# EAGLE schematic Control Unit (EAGLE 9.3.0)
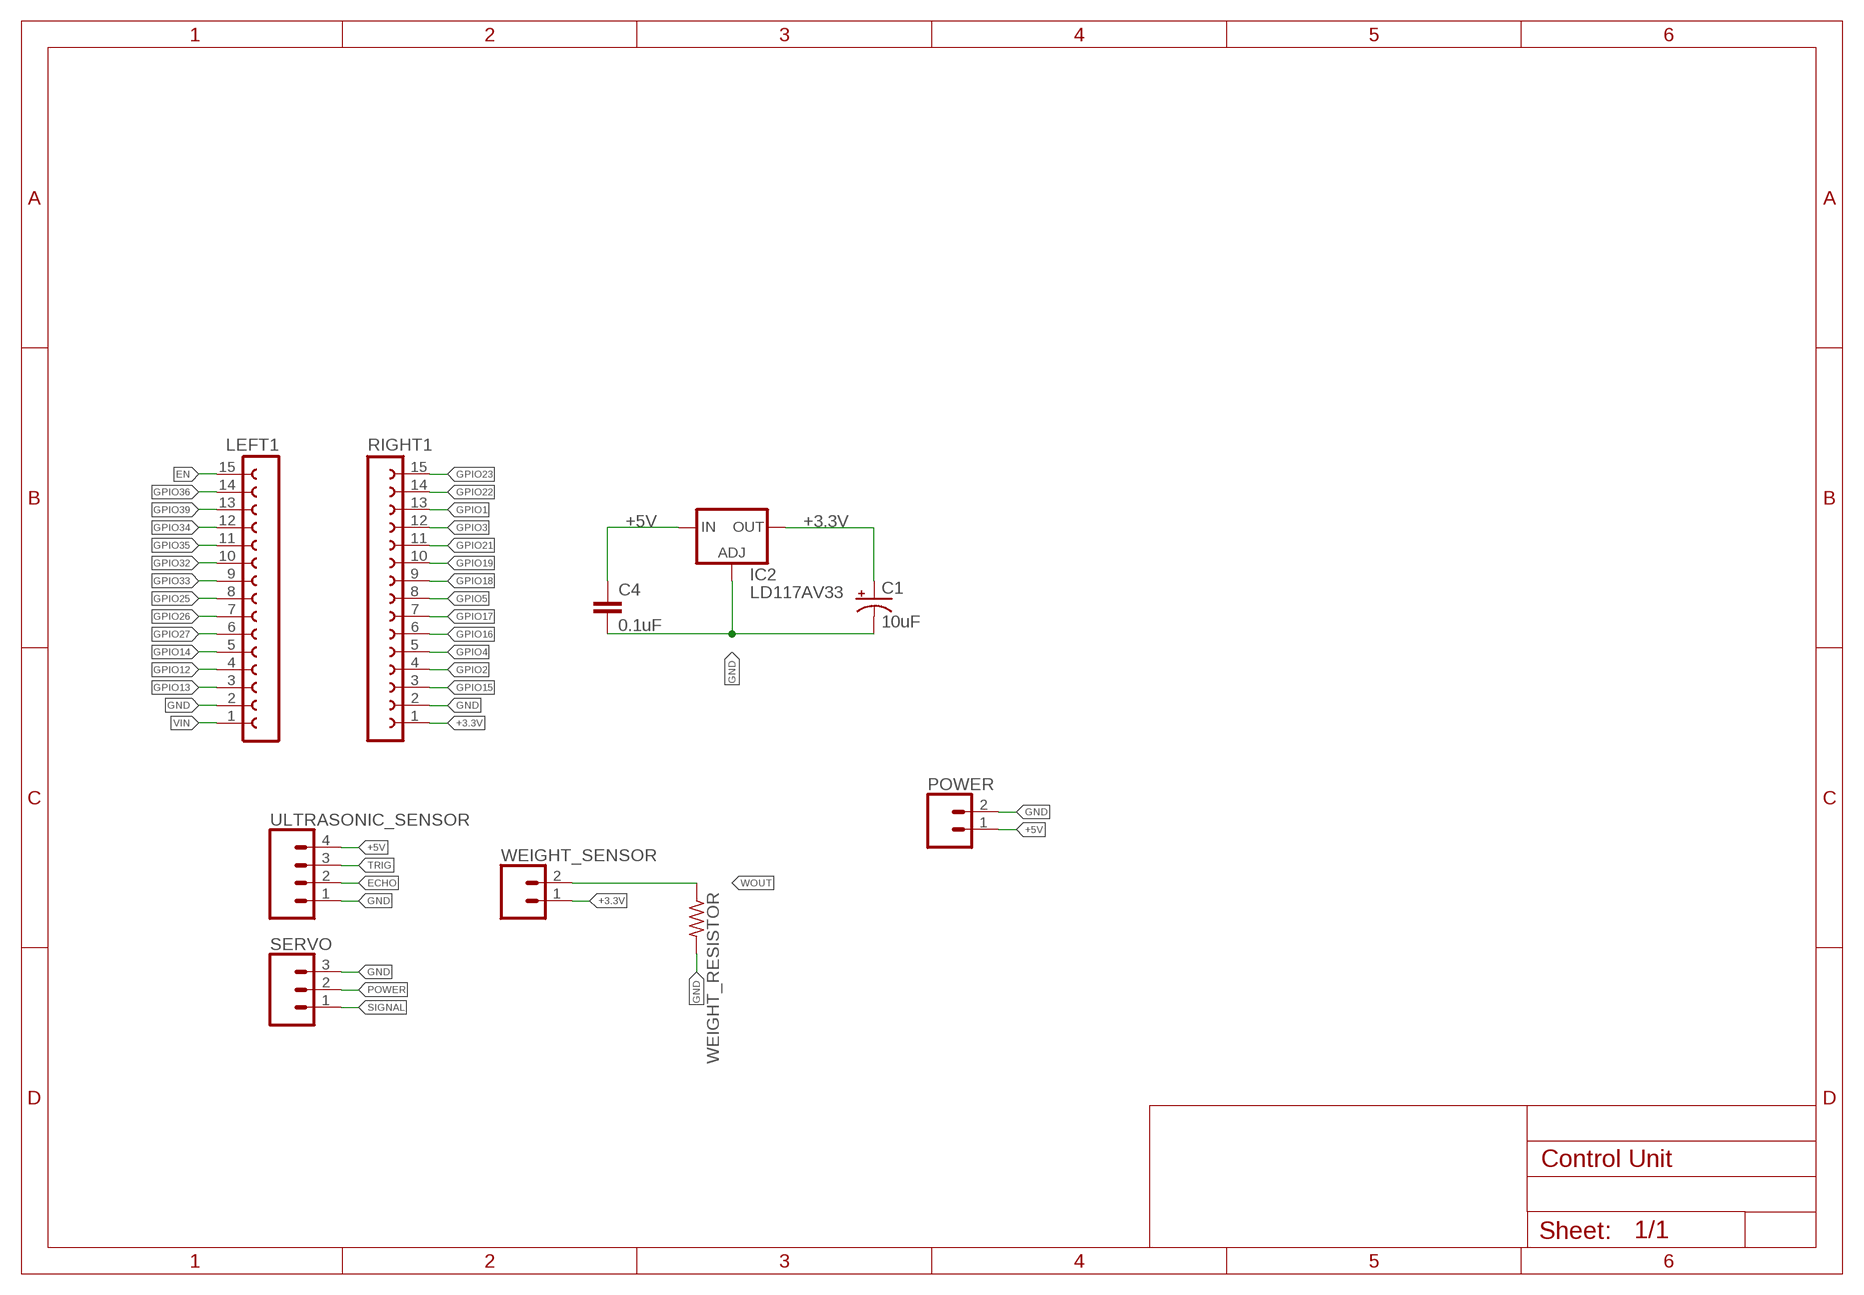
[diagram p0: schematic, sheet 1]

## Parts
C1  10uF  10UF-POLAR-RADIAL-2.5MM-KIT-25V-20%  [CPOL-RADIAL-2.5MM-5MM-KIT]
C4  0.1uF  0.1UF-KIT-EZ-50V-20%  [CAP-PTH-SMALL-KIT]
IC2  LD117AV33  [TO220L1]
LEFT1  FE15-1  [FE15]
POWER  CONN_02LOCK_LONGPADS  [1X02_LOCK_LONGPADS]
RIGHT1  FE15-1  [FE15]
SERVO  CONN_03LONGPADS  [1X03_LONGPADS]
ULTRASONIC_SENSOR  CONN_04LONGPADS  [1X04_LONGPADS]
WEIGHT_RESISTOR  R-US_0207/7  [0207/7]
WEIGHT_SENSOR  CONN_02LOCK_LONGPADS  [1X02_LOCK_LONGPADS]

## Nets
+3.3V: C1.1(+) IC2.2(OUT) RIGHT1.1 WEIGHT_SENSOR.1
+5V: C4.1 IC2.3(IN) POWER.1 ULTRASONIC_SENSOR.4
ECHO: ULTRASONIC_SENSOR.2
EN: LEFT1.15
GND: C1.2(-) C4.2 IC2.1(ADJ) LEFT1.2 POWER.2 RIGHT1.2 SERVO.3 ULTRASONIC_SENSOR.1 WEIGHT_RESISTOR.2
GPIO1: RIGHT1.13
GPIO2: RIGHT1.4
GPIO3: RIGHT1.12
GPIO4: RIGHT1.5
GPIO5: RIGHT1.8
GPIO12: LEFT1.4
GPIO13: LEFT1.3
GPIO14: LEFT1.5
GPIO15: RIGHT1.3
GPIO16: RIGHT1.6
GPIO17: RIGHT1.7
GPIO18: RIGHT1.9
GPIO19: RIGHT1.10
GPIO21: RIGHT1.11
GPIO22: RIGHT1.14
GPIO23: RIGHT1.15
GPIO25: LEFT1.8
GPIO26: LEFT1.7
GPIO27: LEFT1.6
GPIO32: LEFT1.10
GPIO33: LEFT1.9
GPIO34: LEFT1.12
GPIO35: LEFT1.11
GPIO36: LEFT1.14
GPIO39: LEFT1.13
POWER: SERVO.2
SIGNAL: SERVO.1
TRIG: ULTRASONIC_SENSOR.3
VIN: LEFT1.1
WOUT: WEIGHT_RESISTOR.1 WEIGHT_SENSOR.2

## Library data of the parts
C1 = SparkFun-Capacitors:10UF-POLAR: 10.0µF polarized capacitors A capacitor is a passive two-terminal electrical component used to store electrical energy temporarily in an electric field.; PROD_ID: CAP-08440
C4 = SparkFun-Capacitors:0.1UF: 0.1µF ceramic capacitors A capacitor is a passive two-terminal electrical component used to store electrical energy temporarily in an electric field.; PROD_ID: CAP-08370
IC2 = v-reg:LD117A?*: Low drop fixed and adjustable positive voltage regulators 1 A Source: http://www.st.com/stonline/products/literature/ds/7194/ld1117axx.pdf
LEFT1 RIGHT1 = con-lsta:FE15-1: FEMALE HEADER; OC_FARNELL: unknown; OC_NEWARK: unknown; SPICEPREFIX: X
POWER WEIGHT_SENSOR = SparkFun-Connectors:CONN_02: Multi connection point. Often used as Generic Header-pin footprint for 0.1 inch spaced/style header connections On any of the 0.1 inch spaced packages, you can populate with these: Break Away Headers - Straight <https://www.sparkfun.com/products/116> (PRT-00116) Break Away Male Headers - Right Angle <https://www.sparkfun.com/products/553> (PRT-00553) Female Headers <https://www.sparkfun.com/products/115> (PRT-00115) Break Away Headers - Machine Pin <https://www.sparkfun.com/products/117> (PRT-00117) Break Away Female Headers - Swiss Machine Pin <https://www.sparkfun.com/products/743> (PRT-00743) For SCREWTERMINALS and SPRING TERMINALS visit here: Screw Terimnals on SparkFun.com <https://www.sparkfun.com/search/results?term=Screw+Terminals> (5mm/3.5mm/2.54mm spacing) This device is also useful as a general connection point to wire up your design to another part of your project. Our various solder wires solder well into these plated through hole pads. Hook-Up Wire - Assortment (Stranded, 22 AWG) <https://www.sparkfun.com/products/11375> (PRT-11375) Hook-Up Wire - Assortment (Solid Core, 22 AWG) <https://www.sparkfun.com/products/11367> (PRT-11367) View the entire wire category on our website here <https://www.sparkfun.com/categories/141> Special notes: Molex polarized connector foot print use with: PRT-08233 with associated crimp pins and housings. 2.54_SCREWTERM for use with PRT-10571. 3.5mm Screw Terminal footprints for PRT-08084 5mm Screw Terminal footprints for use with PRT-08432
SERVO = SparkFun-Connectors:CONN_03: Multi connection point. Often used as Generic Header-pin footprint for 0.1 inch spaced/style header connections On any of the 0.1 inch spaced packages, you can populate with these: Break Away Headers - Straight <https://www.sparkfun.com/products/116> (PRT-00116) Break Away Male Headers - Right Angle <https://www.sparkfun.com/products/553> (PRT-00553) Female Headers <https://www.sparkfun.com/products/115> (PRT-00115) Break Away Headers - Machine Pin <https://www.sparkfun.com/products/117> (PRT-00117) Break Away Female Headers - Swiss Machine Pin <https://www.sparkfun.com/products/743> (PRT-00743) Stackable Header - 3 Pin (Female, 0.1") <https://www.sparkfun.com/products/13875> (PRT-13875) For SCREWTERMINALS and SPRING TERMINALS visit here: Screw Terimnals on SparkFun.com <https://www.sparkfun.com/search/results?term=Screw+Terminals> (5mm/3.5mm/2.54mm spacing) This device is also useful as a general connection point to wire up your design to another part of your project. Our various solder wires solder well into these plated through hole pads. Hook-Up Wire - Assortment (Stranded, 22 AWG) <https://www.sparkfun.com/products/11375> (PRT-11375) Hook-Up Wire - Assortment (Solid Core, 22 AWG) <https://www.sparkfun.com/products/11367> (PRT-11367) View the entire wire category on our website here <https://www.sparkfun.com/categories/141> Special notes: Molex polarized connector foot print use with SKU : PRT-08232 with associated crimp pins and housings.
ULTRASONIC_SENSOR = SparkFun-Connectors:CONN_04: Multi connection point. Often used as Generic Header-pin footprint for 0.1 inch spaced/style header connections On any of the 0.1 inch spaced packages, you can populate with these: Break Away Headers - Straight <https://www.sparkfun.com/products/116> (PRT-00116) Break Away Male Headers - Right Angle <https://www.sparkfun.com/products/553> (PRT-00553) Female Headers <https://www.sparkfun.com/products/115> (PRT-00115) Break Away Headers - Machine Pin <https://www.sparkfun.com/products/117> (PRT-00117) Break Away Female Headers - Swiss Machine Pin <https://www.sparkfun.com/products/743> (PRT-00743) For SCREWTERMINALS and SPRING TERMINALS visit here: Screw Terimnals on SparkFun.com <https://www.sparkfun.com/search/results?term=Screw+Terminals> (5mm/3.5mm/2.54mm spacing) This device is also useful as a general connection point to wire up your design to another part of your project. Our various solder wires solder well into these plated through hole pads. Hook-Up Wire - Assortment (Stranded, 22 AWG) <https://www.sparkfun.com/products/11375> (PRT-11375) Hook-Up Wire - Assortment (Solid Core, 22 AWG) <https://www.sparkfun.com/products/11367> (PRT-11367) View the entire wire category on our website here <https://www.sparkfun.com/categories/141> Special notes: Molex polarized connector foot print use with SKU : PRT-08231 with associated crimp pins and housings. 1MM SMD Version SKU: PRT-10208; PROD_ID: CONN-09696
WEIGHT_RESISTOR = rcl:R-US_: RESISTOR, American symbol; SPICEPREFIX: R